# EAGLE design ATtiny-13-adapter (EAGLE 9.1.0)
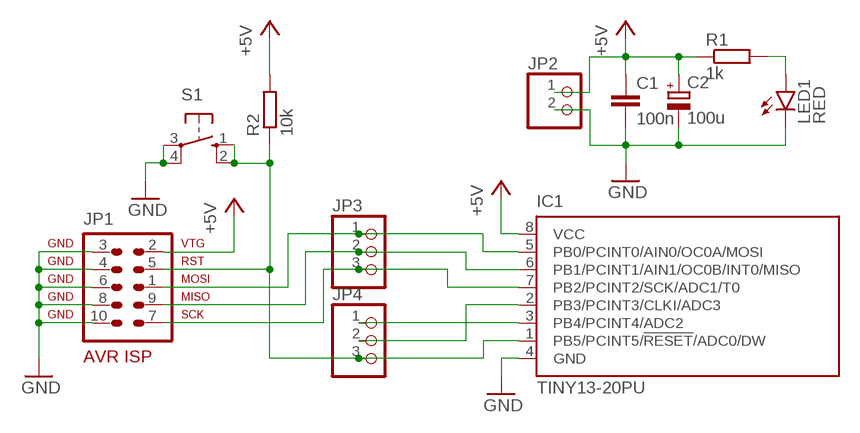
[diagram p0: schematic, sheet 1]

## Parts
C1  100n  C-EUC1206  [C1206]
C2  100u  CPOL-EUE2-5  [E2-5]
IC1  TINY13-20PU  [DIL08]
JP1  AVR-ISP-10ML  [ML10]
JP2  PINHD-1X2  [1X02]
JP3  PINHD-1X3  [1X03]
JP4  PINHD-1X3  [1X03]
LED1  RED  LED3MM  [LED3MM]
R1  1k  R-EU_R1206  [R1206]
R2  10k  R-EU_R1206  [R1206]
S1  10-XX  [B3F-10XX]

## Nets
+5V: C1.1 C2.+ IC1.8(VCC) JP1.2 JP2.1 R1.1 R2.2
GND: C1.2 C2.- IC1.4(GND) JP1.3 JP1.4 JP1.6 JP1.8 JP1.10 JP2.2 LED1.K(C) S1.3(P) S1.4(P1)
N$1: IC1.5(PB0/PCINT0/AIN0/OC0A/MOSI) JP1.1 JP3.1
N$2: IC1.6(PB1/PCINT1/AIN1/OC0B/INT0/MISO) JP1.9 JP3.2
N$3: LED1.A R1.2
N$4: IC1.7(PB2/PCINT2/SCK/ADC1/T0) JP1.7 JP3.3
N$5: IC1.2(PB3/PCINT3/CLKI/ADC3) JP4.2
N$6: IC1.3(PB4/PCINT4/ADC2) JP4.1
N$9: IC1.1(PB5/PCINT5/!RESET!/ADC0/DW) JP1.5 JP4.3 R2.1 S1.1(S) S1.2(S1)

## Library data of the parts
C1 = rcl:C-EU: CAPACITOR, European symbol; SPICEPREFIX: C
C2 = rcl:CPOL-EU: POLARIZED CAPACITOR, European symbol; SPICEPREFIX: C
IC1 = atmel:TINY13: 8-bit AVR Microcontroller with 1K Bytes In-System Programmable Flash Source: http://www.atmel.com/dyn/resources/prod_documents/2535S.pdf; MPN: ATTINY13-20PU; OC_FARNELL: 9171550; OC_NEWARK: 96K6521
JP1 = atmel-1:AVR-ISP-10: AVR ISP-10 Serial Programming Header
JP2 = pinhead:PINHD-1X2: PIN HEADER
JP3 JP4 = pinhead:PINHD-1X3: PIN HEADER
LED1 = led:LED: LED OSRAM: - CHIPLED LG R971, LG N971, LY N971, LG Q971, LY Q971, LO R971, LY R971 LH N974, LH R974 LS Q976, LO Q976, LY Q976 LO Q996 - Hyper CHIPLED LW Q18S LB Q993, LB Q99A, LB R99A - SideLED LS A670, LO A670, LY A670, LG A670, LP A670 LB A673, LV A673, LT A673, LW A673 LH A674 LY A675 LS A676, LA A676, LO A676, LY A676, LW A676 LS A679, LY A679, LG A679 - Hyper Micro SIDELED® LS Y876, LA Y876, LO Y876, LY Y876 LT Y87S - SmartLED LW L88C, LW L88S LB L89C, LB L89S, LG L890 LS L89K, LO L89K, LY L89K LS L896, LA L896, LO L896, LY L896 - TOPLED LS T670, LO T670, LY T670, LG T670, LP T670 LSG T670, LSP T670, LSY T670, LOP T670, LYG T670 LG T671, LOG T671, LSG T671 LB T673, LV T673, LT T673, LW T673 LH T674 LS T676, LA T676, LO T676, LY T676, LB T676, LH T676, LSB T676, LW T676 LB T67C, LV T67C, LT T67C, LS T67K, LO T67K, LY T67K, LW E67C LS E67B, LA E67B, LO E67B, LY E67B, LB E67C, LV E67C, LT E67C LW T67C LS T679, LY T679, LG T679 LS T770, LO T770, LY T770, LG T770, LP T770 LB T773, LV T773, LT T773, LW T773 LH T774 LS E675, LA E675, LY E675, LS T675 LS T776, LA T776, LO T776, LY T776, LB T776 LHGB T686 LT T68C, LB T68C - Hyper Mini TOPLED® LB M676 - Mini TOPLED Santana® LG M470 LS M47K, LO M47K, LY M47K Source: http://www.osram.convergy.de LUXEON: - LUMILED® LXK2-PW12-R00, LXK2-PW12-S00, LXK2-PW14-U00, LXK2-PW14-V00 LXK2-PM12-R00, LXK2-PM12-S00, LXK2-PM14-U00 LXK2-PE12-Q00, LXK2-PE12-R00, LXK2-PE12-S00, LXK2-PE14-T00, LXK2-PE14-U00 LXK2-PB12-K00, LXK2-PB12-L00, LXK2-PB12-M00, LXK2-PB14-N00, LXK2-PB14-P00, LXK2-PB14-Q00 LXK2-PR12-L00, LXK2-PR12-M00, LXK2-PR14-Q00, LXK2-PR14-R00 LXK2-PD12-Q00, LXK2-PD12-R00, LXK2-PD12-S00 LXK2-PH12-R00, LXK2-PH12-S00 LXK2-PL12-P00, LXK2-PL12-Q00, LXK2-PL12-R00 Source: www.luxeon.com KINGBRIGHT: KA-3528ASYC Source: www.kingbright.com
R1 R2 = rcl:R-EU_: RESISTOR, European symbol; SPICEPREFIX: R
S1 = switch-omron:10-XX: OMRON SWITCH; MPN: B3F-1000; OC_FARNELL: 176432; OC_NEWARK: 36M3542

## Board
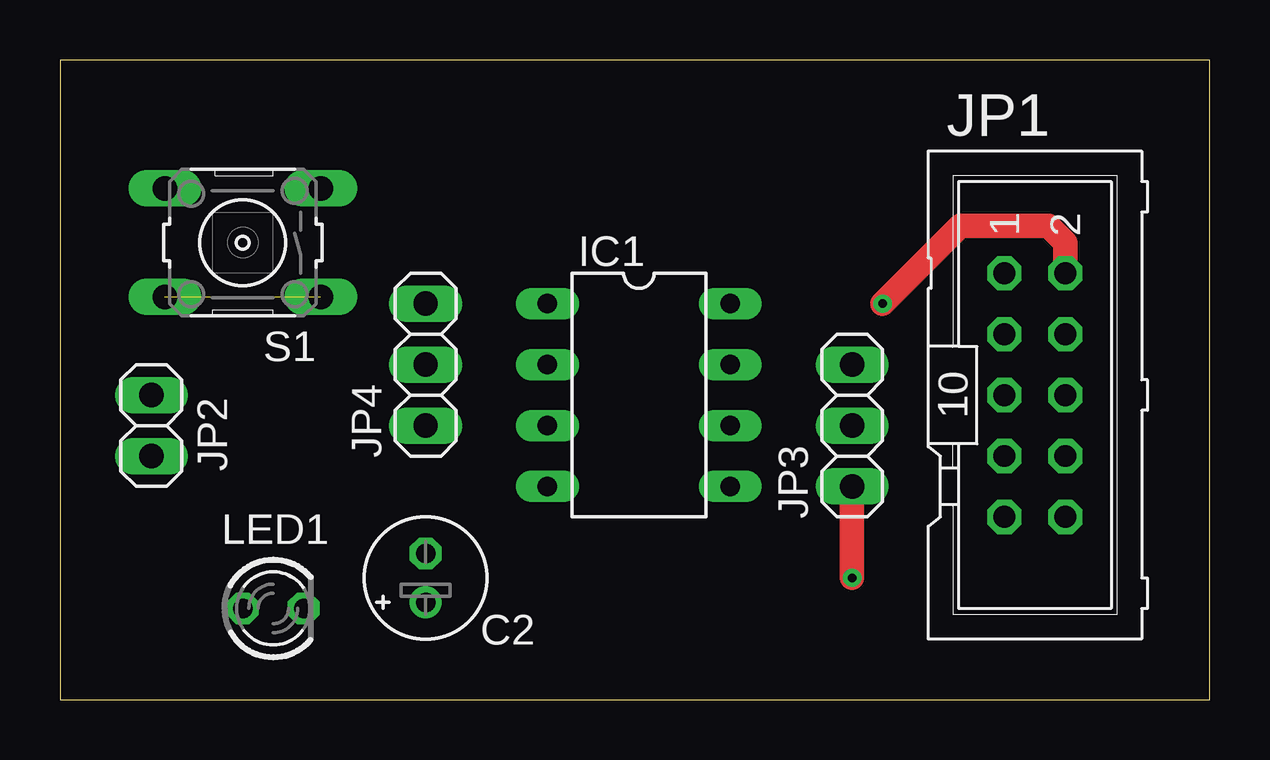
[diagram p1: board, top side]
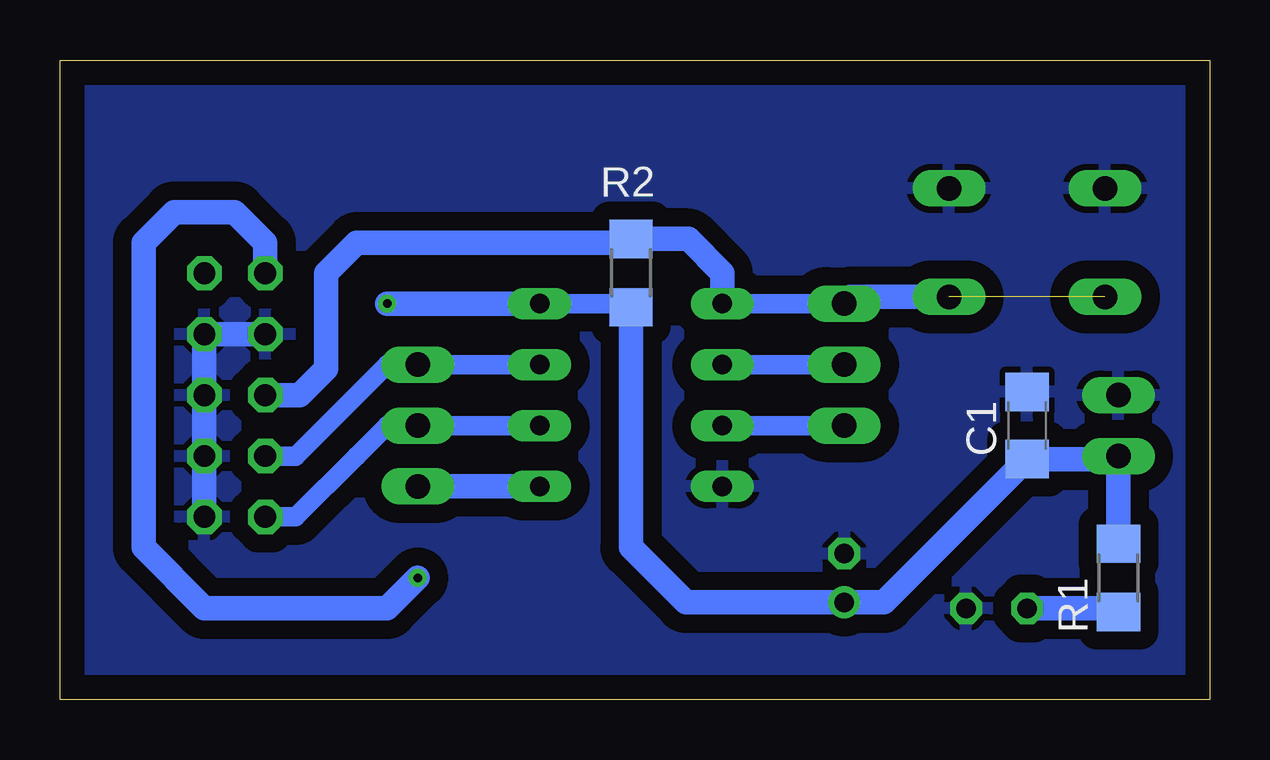
[diagram p2: board, bottom side, seen from below]

Size 47.93 x 26.66 mm. Coordinates in mm from the lower left corner, seen from the top.
Outline: 0,0 47.93,0 47.93,26.66 0,26.66 0,0
Copper layers (1*16): Top 0.035mm / dielectric 1.5mm / Bottom 0.035mm
Design rules "default *": minimum track width 6mil, minimum drill 0.35mm, track to track 30mil, track to pad 30mil, pad to pad 6mil, via to via 6mil, smd to smd 6mil, copper to edge 40mil, drill to drill 6mil, minimum pad ring 10mil, minimum via ring 8mil, stop-mask expansion 4mil, vias tented up to drill 0mil, thermal gap 10mil

### Footprints (pad centres in the part's own frame; a part is rotated, then mirrored left to right if it is on the bottom)
C1206 = smd 1.6 x 1.8: 1 -1.4,0; 2 1.4,0
E2-5 = drill 0.813 pad 1.27: + -1.016,0 | drill 0.813 pad 1.27 octagon: - 1.016,0
DIL08 = drill 0.813 long: 1 -3.81,-3.81; 2 -1.27,-3.81; 3 1.27,-3.81; 4 3.81,-3.81; 5 3.81,3.81; 6 1.27,3.81; 7 -1.27,3.81; 8 -3.81,3.81
ML10 = drill 0.914 octagon: 1 -5.08,-1.27; 2 -5.08,1.27; 3 -2.54,-1.27; 4 -2.54,1.27; 5 0,-1.27; 6 0,1.27; 7 2.54,-1.27; 8 2.54,1.27; 9 5.08,-1.27; 10 5.08,1.27
1X02 = drill 1.016 long: 1 -1.27,0; 2 1.27,0
1X03 = drill 1.016 long: 1 -2.54,0; 2 0,0; 3 2.54,0
LED3MM = drill 0.813 octagon: A -1.27,0; K 1.27,0
R1206 = smd 1.6 x 1.803: 1 -1.422,0; 2 1.422,0
B3F-10XX = drill 1.016 long: 1 -3.251,2.261; 2 3.251,2.261; 3 -3.251,-2.261; 4 3.251,-2.261

### Placement (x,y rotation side)
C1  7.62,11.43 90 bottom
C2  15.24,5.08 90 top
IC1  24.13,12.7 270 top
JP1  40.64,12.7 270 top
JP2  3.81,11.43 90 top
JP3  33.02,11.43 90 top
JP4  15.24,13.97 90 top
LED1  8.89,3.81 0 top
R1  3.81,5.08 270 bottom
R2  24.13,17.78 270 bottom
S1  7.62,19.05 180 top

### Tracks (layer width: path | path; a pad name or v marks a point on that pad's centre or on a via)
+5V  (via drill 0.35)
  Top 1.016: JP1.2 41.91,19.05 41.2,19.76 37.54,19.76 v34.29,16.51
  Bottom 0.813: R2.2 24.28,16.51 IC1.8
  Bottom 1.016: IC1.8 v34.29,16.51 | R2.2 24.13,6.35 21.84,4.06 C2.+ 13.59,4.06 C1.1 3.94,10.03 JP2.1 R1.1
GND
  Bottom 0.813: 7.75,12.7 C1.2
  Bottom 1.016: JP1.3 JP1.4 JP1.10
  pour Bottom: 0,0 46.99,0 46.99,26.67 0,26.67
N$1  (via drill 0.35)
  Top 1.016: v33.02,5.08 JP3.1
  Bottom 1.016: JP1.1 39.37,19.05 40.64,20.32 43.18,20.32 44.45,19.05 44.45,6.35 41.91,3.81 34.29,3.81 v33.02,5.08 | IC1.5 JP3.1
N$2
  Bottom 0.813: IC1.6 JP3.2 34.29,11.43 35.56,10.16 38.1,7.62 JP1.9
N$3
  Bottom 1.016: LED1.A 3.96,3.81 R1.2
N$4
  Bottom 0.813: IC1.7 JP3.3 34.29,13.97 38.1,10.16 JP1.7
N$5
  Bottom 0.813: IC1.2 JP4.2
N$6
  Bottom 0.813: JP4.1 IC1.3
N$9  (1 unrouted)
  Bottom 0.813: JP4.3 IC1.1
  Bottom 1.016: IC1.1 20.32,17.78 21.74,19.2 R2.1 24.28,19.05 35.56,19.05 36.83,17.78 36.83,13.8 37.93,12.7 JP1.5 | JP4.3 14.96,16.79 S1.1